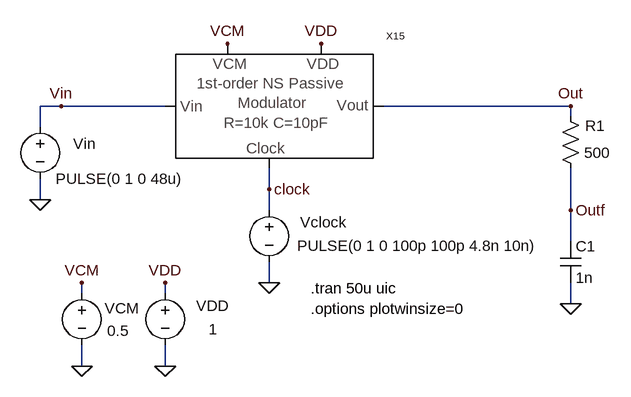
[diagram p0: schematic _Fig6_16_v2_MSD.asc]
_Fig6_16_v2_MSD.asc, the LTspice schematic file:
Version 4
SHEET 1 3504 680
WIRE 80 -224 48 -224
WIRE 240 -224 80 -224
WIRE 864 -224 576 -224
WIRE 864 -208 864 -224
WIRE 48 -192 48 -224
WIRE 400 -96 400 -128
WIRE 48 -80 48 -112
WIRE 400 -64 400 -96
WIRE 864 -64 864 -128
WIRE 864 -16 864 -64
WIRE 400 48 400 16
WIRE 112 64 112 48
WIRE 240 64 240 48
WIRE 864 80 864 48
WIRE 112 176 112 144
WIRE 240 176 240 144
FLAG 240 176 0
FLAG 480 -320 VDD
FLAG 240 48 VDD
FLAG 400 48 0
FLAG 400 -96 clock
FLAG 112 176 0
FLAG 112 48 VCM
FLAG 48 -80 0
FLAG 80 -224 Vin
FLAG 336 -320 VCM
FLAG 864 -224 Out
FLAG 864 80 0
FLAG 864 -64 Outf
SYMBOL voltage 240 48 R0
WINDOW 0 48 35 Left 0
WINDOW 3 67 71 Left 0
SYMATTR InstName VDD
SYMATTR Value 1
SYMBOL voltage 400 -80 R0
WINDOW 0 48 35 Left 0
WINDOW 3 43 71 Left 0
WINDOW 123 0 0 Left 0
WINDOW 39 0 0 Left 0
SYMATTR InstName Vclock
SYMATTR Value PULSE(0 1 0 100p 100p 4.8n 10n)
SYMBOL voltage 112 48 R0
WINDOW 0 35 39 Left 0
WINDOW 3 39 74 Left 0
SYMATTR InstName VCM
SYMATTR Value 0.5
SYMBOL voltage 48 -208 R0
WINDOW 0 51 42 Left 0
WINDOW 123 0 0 Left 0
WINDOW 39 0 0 Left 0
SYMATTR InstName Vin
SYMATTR Value PULSE(0 1 0 48u)
SYMBOL res 880 -112 R180
WINDOW 0 -37 82 Left 0
WINDOW 3 -45 40 Left 0
SYMATTR InstName R1
SYMATTR Value 500
SYMBOL cap 848 -16 R0
SYMATTR InstName C1
SYMATTR Value 1n
SYMBOL 1_bit_1st_PNS_mod_MSD 256 -144 R0
SYMATTR InstName X15
TEXT 464 56 Left 0 !.tran 50u uic
TEXT 464 88 Left 0 !.options plotwinsize=0

The netlist it stands for:
* _Fig6_16_v2_MSD.asc
VDD VDD 0 1
Vclock clock 0 PULSE(0 1 0 100p 100p 4.8n 10n)
VCM VCM 0 0.5
Vin Vin 0 PULSE(0 1 0 48u)
R1 Outf Out 500
C1 Outf 0 1n
XX15 Vin VDD Out clock VCM 1_bit_1st_PNS_mod_MSD  ; pins Vin VDD Vout Clock VCM
.tran 50u uic
.options plotwinsize=0
.backanno
.end